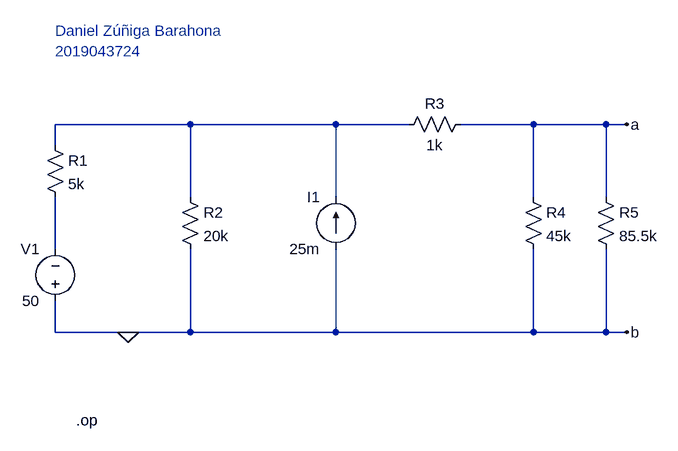
[diagram p0: schematic Ejercicio2.asc]
Ejercicio2.asc, the LTspice schematic file:
Version 4
SHEET 1 1032 680
WIRE 288 -32 80 -32
WIRE 512 -32 288 -32
WIRE 624 -32 512 -32
WIRE 816 -32 704 -32
WIRE 928 -32 816 -32
WIRE 960 -32 928 -32
WIRE 80 0 80 -32
WIRE 288 80 288 -32
WIRE 512 80 512 -32
WIRE 816 80 816 -32
WIRE 928 80 928 -32
WIRE 80 160 80 80
WIRE 80 288 80 240
WIRE 192 288 80 288
WIRE 288 288 288 160
WIRE 288 288 192 288
WIRE 512 288 512 160
WIRE 512 288 288 288
WIRE 816 288 816 160
WIRE 816 288 512 288
WIRE 928 288 928 160
WIRE 928 288 816 288
WIRE 960 288 928 288
FLAG 192 288 0
FLAG 960 -32 a
FLAG 960 288 b
DATAFLAG 928 0 "$*I(R5)"
SYMBOL voltage 80 256 R180
WINDOW 0 24 96 Left 2
WINDOW 3 24 16 Left 2
WINDOW 123 0 0 Left 0
WINDOW 39 0 0 Left 0
SYMATTR InstName V1
SYMATTR Value 50
SYMBOL res 64 -16 R0
SYMATTR InstName R1
SYMATTR Value 5k
SYMBOL res 272 64 R0
SYMATTR InstName R2
SYMATTR Value 20k
SYMBOL current 512 160 R180
WINDOW 0 24 80 Left 2
WINDOW 3 24 0 Left 2
WINDOW 123 0 0 Left 0
WINDOW 39 0 0 Left 0
SYMATTR InstName I1
SYMATTR Value 25m
SYMBOL res 720 -48 R90
WINDOW 0 0 56 VBottom 2
WINDOW 3 32 56 VTop 2
SYMATTR InstName R3
SYMATTR Value 1k
SYMBOL res 800 64 R0
SYMATTR InstName R4
SYMATTR Value 45k
SYMBOL res 912 64 R0
SYMATTR InstName R5
SYMATTR Value 85.5k
TEXT 80 -176 Left 2 ;Daniel Zúñiga Barahona\n2019043724
TEXT 112 424 Left 2 !.op

The netlist it stands for:
* Ejercicio2.asc
V1 0 N002 50
R1 N001 N002 5k
R2 N001 0 20k
I1 0 N001 25m
R3 a N001 1k
R4 a 0 45k
R5 a 0 85.5k
* Daniel Zúñiga Barahona
* 2019043724
.op
.backanno
.end